# EAGLE design prominifinal-singlelayer (EAGLE 9.5.1)
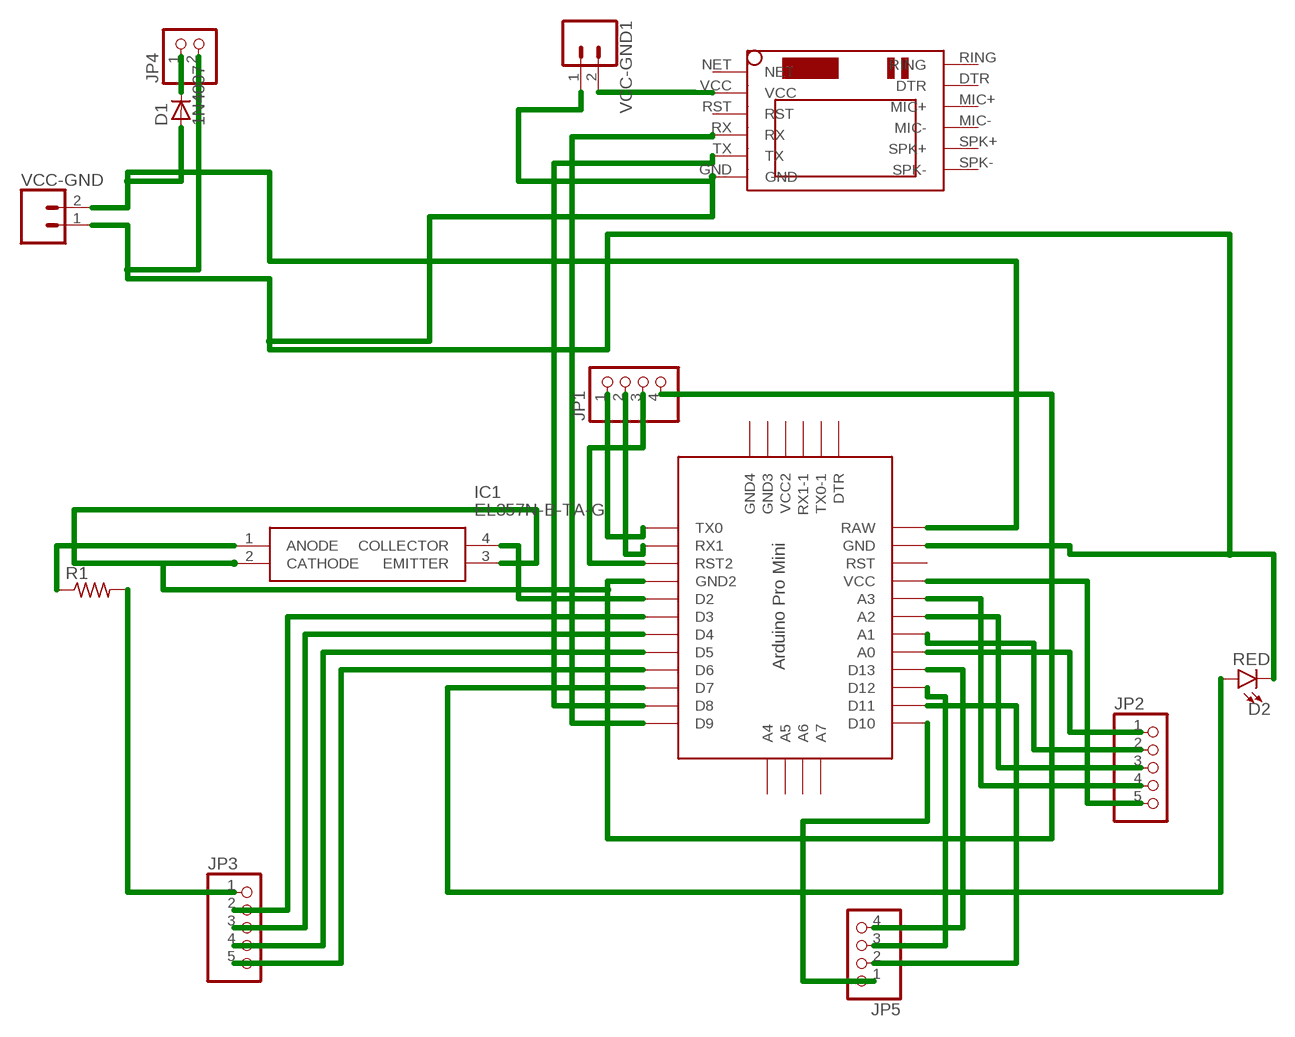
[diagram p0: schematic, sheet 1]

## Parts
D1  1N4007  [SMA]
D2  RED  LED-RED1206  [LED-1206]
IC1  EL357N-B-TA-G  [SOP254P700X200-4N]
JP1  PINHD-1X4  [1X04]
JP2  PINHD-1X5  [1X05]
JP3  PINHD-1X5  [1X05]
JP4  PINHD-1X2  [1X02]
JP5  PINHD-1X4  [1X04]
PROMINI  PRO-MINI  [PRO-MINI]
R1  R-US_R1206  [R1206]
U$1  SIM800LMODULE  [SIM800LMODULE]
VCC-GND  CONN_025MM  [SCREWTERMINAL-5MM-2]
VCC-GND1  CONN_025MM  [SCREWTERMINAL-5MM-2]

## Nets
N$1: D1.A PROMINI.RAW VCC-GND.2
N$2: JP1.1 PROMINI.TX0
N$3: IC1.2(CATHODE) IC1.3(EMITTER) JP1.4 PROMINI.GND1(GND2)
N$4: JP2.1 PROMINI.A0
N$5: IC1.4(COLLECTOR) PROMINI.D2
N$6: PROMINI.D9 U$1.RX
N$7: D2.A PROMINI.D7
N$8: JP3.1 R1.2
N$9: JP3.2 PROMINI.D3
N$10: JP3.3 PROMINI.D4
N$11: JP5.4 PROMINI.D13
N$12: JP3.5 PROMINI.D6
N$13: JP2.2 PROMINI.A1
N$14: JP1.2 PROMINI.RX1
N$15: PROMINI.D8 U$1.TX
N$16: JP2.3 PROMINI.A2
N$17: JP2.4 PROMINI.A3
N$18: JP1.3 PROMINI.RST1(RST2)
N$19: D2.C JP4.2 PROMINI.GND U$1.GND VCC-GND1.1 VCC-GND.1
N$20: U$1.VCC VCC-GND1.2
N$21: JP2.5 PROMINI.VCC
N$22: JP3.4 PROMINI.D5
N$23: JP5.3 PROMINI.D12
N$24: IC1.1(ANODE) R1.1
N$25: JP5.2 PROMINI.D11
N$26: JP5.1 PROMINI.D10
N$27: D1.K(C) JP4.1
Unconnected: PROMINI.A4 PROMINI.A5 PROMINI.A6 PROMINI.A7 PROMINI.DTR PROMINI.GND2(GND4) PROMINI.GND3 PROMINI.RST PROMINI.RX1-1 PROMINI.TX0-1 PROMINI.VCC1(VCC2) U$1.DTR U$1.MIC+ U$1.MIC- U$1.NET U$1.RING U$1.RST U$1.SPK+ U$1.SPK-

## Library data of the parts
D1 = casovac:1N4007
D2 = SparkFun-LED:LED-RED: Red SMD LED Used in manufacturing of most products at SparkFun Packages: 0603 - SMD 0603 package [Product Link] <http://docs.avagotech.com/docs/AV02-0551EN> 0603 SMART - SMD 0603 SMART package ( more efficient and expensive)[Product Link] <http://www.osram-os.com/Graphics/XPic2/00077099_0.pdf> 1206 - SMD1206 package [Product Link] <https://www.sparkfun.com/datasheets/DevTools/LilyPad/Q150OVS4.pdff> SparkFun Products: Pro Mini 328 -5V <https://www.sparkfun.com/products/821> RedBoard <https://www.sparkfun.com/products/12757> IOIO-OTG <https://www.sparkfun.com/products/13613>; PROD_ID: DIO-09912
IC1 = EL357N-B-TA-G:EL357N-B-TA-G: Optoisolator Transistor Output 3750Vrms 1 Channel 4-SOP (2.54mm) Source: Datasheet <https://datasheet.lcsc.com/szlcsc/1809192312_Everlight-Elec-EL357N-B-TA-G_C6649.pdf>; DESCRIPTION: Optoisolator Transistor Output 3750Vrms 1 Channel 4-SOP (2.54mm); HEIGHT: 2mm; MANUFACTURER_NAME: Everlight Elec; MANUFACTURER_PART_NUMBER: EL357N-B-TA-G
JP1 JP5 = pinhead:PINHD-1X4: PIN HEADER
JP2 JP3 = pinhead:PINHD-1X5: PIN HEADER
JP4 = pinhead:PINHD-1X2: PIN HEADER
PROMINI = Arduino-clone:PRO-MINI: Arduion Pro Mini Clone V1.0 www.betemcu.cu
R1 = rcl:R-US_: RESISTOR, American symbol; SPICEPREFIX: R
U$1 = SIM800LMODULE:SIM800LMODULE: SIM800L Module
VCC-GND VCC-GND1 = SparkFun-Retired:CONN_02: Multi connection point. Often used as Generic Header-pin footprint for 0.1 inch spaced/style header connections On any of the 0.1 inch spaced packages, you can populate with these: Break Away Headers - Straight <https://www.sparkfun.com/products/116> (PRT-00116) Break Away Male Headers - Right Angle <https://www.sparkfun.com/products/553> (PRT-00553) Female Headers <https://www.sparkfun.com/products/115> (PRT-00115) Break Away Headers - Machine Pin <https://www.sparkfun.com/products/117> (PRT-00117) Break Away Female Headers - Swiss Machine Pin <https://www.sparkfun.com/products/743> (PRT-00743) For SCREWTERMINALS and SPRING TERMINALS visit here: Screw Terimnals on SparkFun.com <https://www.sparkfun.com/search/results?term=Screw+Terminals> (5mm/3.5mm/2.54mm spacing) This device is also useful as a general connection point to wire up your design to another part of your project. Our various solder wires solder well into these plated through hole pads. Hook-Up Wire - Assortment (Stranded, 22 AWG) <https://www.sparkfun.com/products/11375> (PRT-11375) Hook-Up Wire - Assortment (Solid Core, 22 AWG) <https://www.sparkfun.com/products/11367> (PRT-11367) View the entire wire category on our website here <https://www.sparkfun.com/categories/141> Special notes: Molex polarized connector foot print use with: PRT-08233 with associated crimp pins and housings. 2.54_SCREWTERM for use with PRT-10571. 3.5mm Screw Terminal footprints for PRT-08084 5mm Screw Terminal footprints for use with PRT-08432; SF_SKU: PRT-08432

## Board
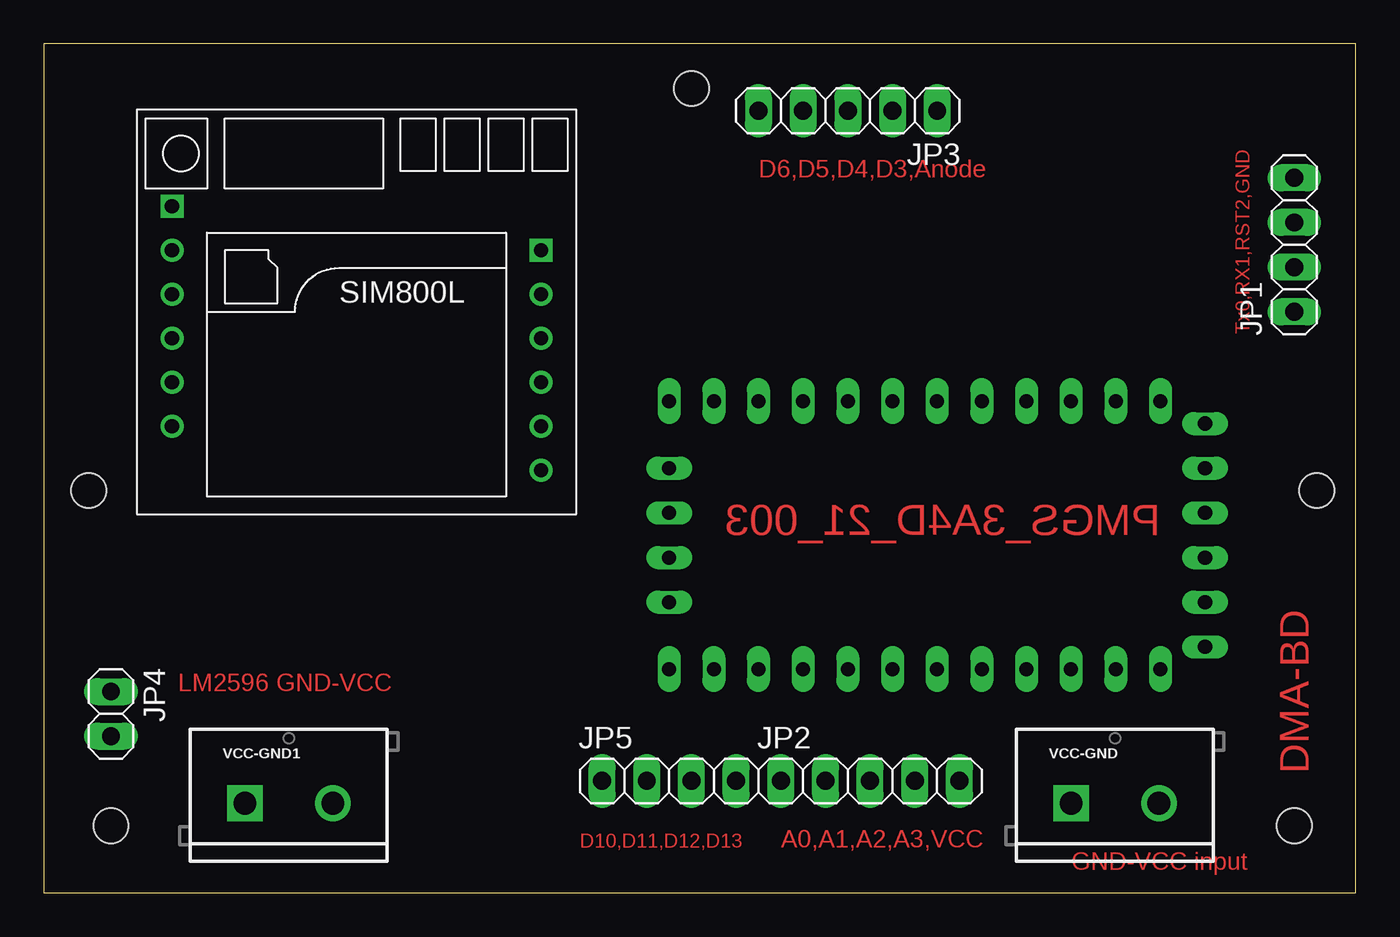
[diagram p1: board, top side]
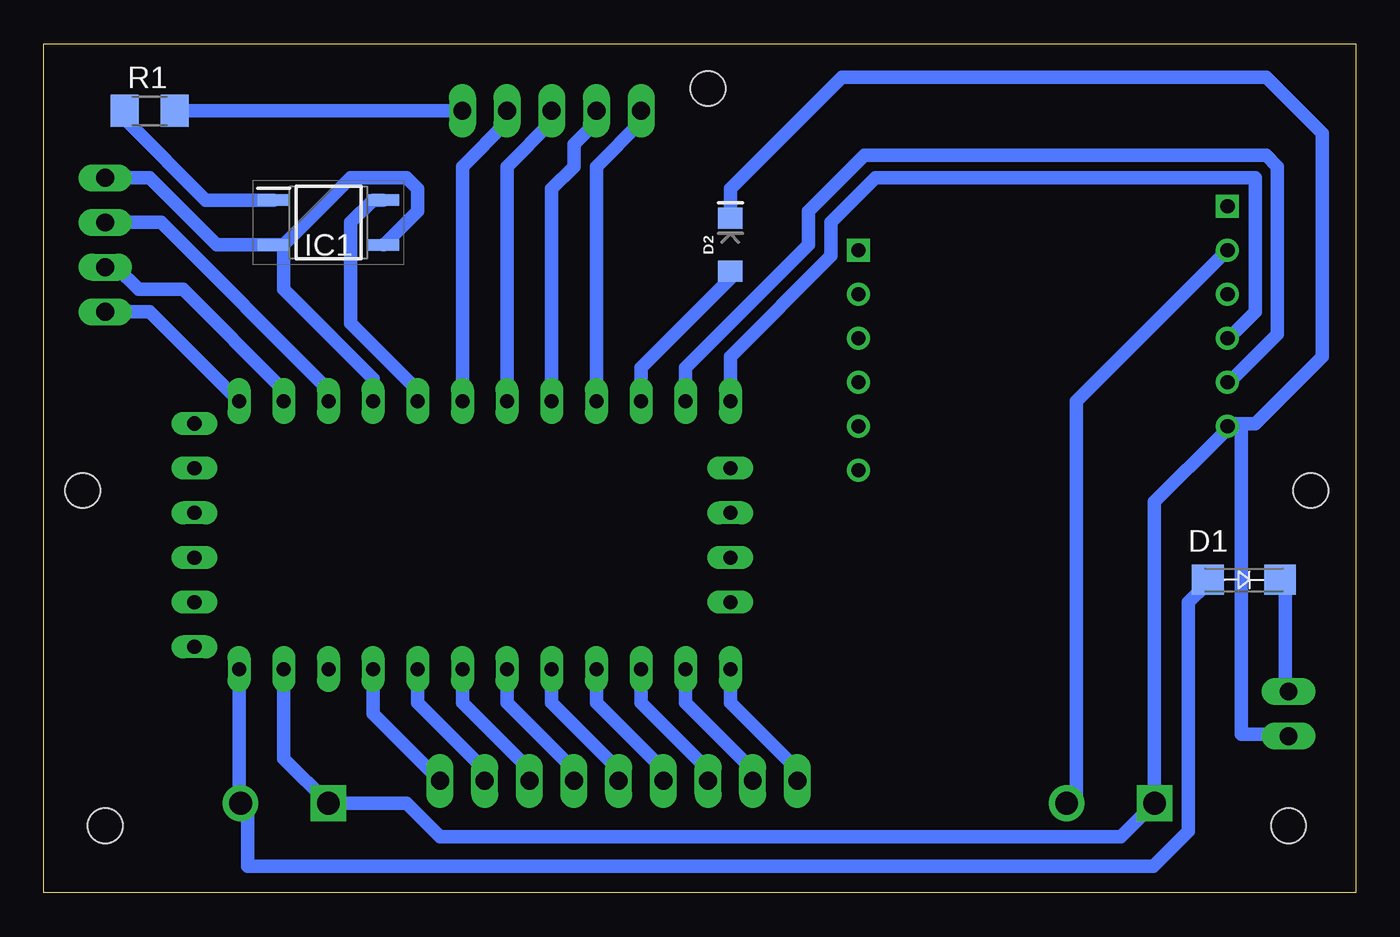
[diagram p2: board, bottom side, seen from below]

Size 74.6 x 48.25 mm. Coordinates in mm from the lower left corner, seen from the top.
Outline: 0,0 74.6,0 74.6,48.25 0,48.25 0,0
Copper layers (1*16): Top 0.035mm / dielectric 1.5mm / Bottom 0.035mm
Design rules "default *": minimum track width 30mil, minimum drill 0.35mm, track to track 20mil, track to pad 20mil, pad to pad 6mil, via to via 6mil, smd to smd 6mil, copper to edge 40mil, drill to drill 6mil, minimum pad ring 10mil, minimum via ring 8mil, stop-mask expansion 4mil, vias tented up to drill 0mil, thermal gap 10mil
Holes 2 mm at 2.54,22.86 72.39,22.86 71.12,3.81 3.81,3.81 36.83,45.72

### Footprints (pad centres in the part's own frame; a part is rotated, then mirrored left to right if it is on the bottom)
SMA = smd 1.8 x 1.7: A -2.05,0; K 2.05,0
LED-1206 = smd 1.2 x 1.4: A -1.5,0; C 1.5,0
SOP254P700X200-4N = smd 1.825 x 0.65: 1 -3.112,1.27; 2 -3.112,-1.27; 3 3.112,-1.27; 4 3.112,1.27
1X04 = drill 1.016 long: 1 -3.81,0; 2 -1.27,0; 3 1.27,0; 4 3.81,0
1X05 = drill 1.016 long: 1 -5.08,0; 2 -2.54,0; 3 0,0; 4 2.54,0; 5 5.08,0
1X02 = drill 1.016 long: 1 -1.27,0; 2 1.27,0
PRO-MINI = drill 0.8 long: A0 8.89,8.89; A1 8.89,11.43; A2 8.89,13.97; A3 8.89,16.51; A4 -2.54,-1.27; A5 0,-1.27; A6 2.54,-1.27; A7 5.08,-1.27; D2 -6.35,16.51; D3 -6.35,13.97; D4 -6.35,11.43; D5 -6.35,8.89; D6 -6.35,6.35; D7 -6.35,3.81; D8 -6.35,1.27; D9 -6.35,-1.27; D10 8.89,-1.27; D11 8.89,1.27; D12 8.89,3.81; D13 8.89,6.35; DTR 7.62,29.21; GND 8.89,24.13; GND1 -6.35,19.05; GND2 -5.08,29.21; GND3 -2.54,29.21; RAW 8.89,26.67; RST 8.89,21.59; RST1 -6.35,21.59; RX1 -6.35,24.13; RX1-1 2.54,29.21; TX0 -6.35,26.67; TX0-1 5.08,29.21; VCC 8.89,19.05; VCC1 0,29.21
R1206 = smd 1.6 x 1.803: 1 -1.422,0; 2 1.422,0
SIM800LMODULE = drill 0.8: DTR 10.5,1; GND -10.5,-6.5; MIC+ 10.5,-1.5; MIC- 10.5,-4; RST -10.5,1; RX -10.5,-1.5; SPK+ 10.5,-6.5; SPK- 10.5,-9; TX -10.5,-4; VCC -10.5,3.5 | drill 0.8 square: NET -10.5,6; RING 10.5,3.5
SCREWTERMINAL-5MM-2 = drill 1.3 pad 2.032 square: 1 0,0 | drill 1.3 pad 2.032: 2 5,0

### Placement (x,y rotation side)
D1  6.35,17.78 0 bottom
D2  35.56,36.83 90 bottom
IC1  58.42,38.1 0 bottom
JP1  71.12,36.83 90 top
JP2  46.99,6.35 0 top
JP3  45.72,44.45 180 top
JP4  3.81,10.16 270 top
JP5  35.56,6.35 0 top
PROMINI  36.83,21.59 270 top
R1  68.58,44.45 0 bottom
U$1  17.78,33.02 0 top
VCC-GND  58.42,5.08 0 top
VCC-GND1  11.43,5.08 0 top

### Tracks (layer width: path | path; a pad name or v marks a point on that pad's centre or on a via)
N$1
  Bottom 0.762: PROMINI.RAW 63.5,5.08 VCC-GND.2 63,5 63,1.5 11.5,1.5 9.5,3.5 9.5,16.5 8.5,17.5 D1.A
N$2
  Bottom 0.762: PROMINI.TX0 68.58,33.02 JP1.1
N$3
  Bottom 0.762: 60.96,36.83 57.15,40.64 53.98,40.64 53.34,40.01 53.34,38.73 55.24,36.83 IC1.3 | PROMINI.GND1 55.88,29.21 60.96,34.29 60.96,36.83 | 60.96,36.83 IC1.2 64.77,36.83 68.58,40.64 JP1.4
N$4
  Bottom 0.762: PROMINI.A0 45.72,10.79 41.91,6.99 JP2.1
N$5
  Bottom 0.762: PROMINI.D2 53.34,28.57 57.15,32.38 57.15,38.1 55.88,39.37 IC1.4
N$6
  Bottom 0.762: PROMINI.D9 35.56,30.48 29.84,36.2 29.84,38.1 27.3,40.64 5.71,40.64 5.71,33.02 6.99,31.75 U$1.RX
N$7
  Bottom 0.762: PROMINI.D7 40.64,29.84 35.56,34.92 D2.A
N$8
  Bottom 0.762: JP3.1 R1.2
N$9
  Bottom 0.762: PROMINI.D3 50.8,41.27 48.26,43.81 JP3.2
N$10
  Bottom 0.762: PROMINI.D4 48.26,41.27 45.72,43.81 JP3.3
N$11
  Bottom 0.762: PROMINI.D13 43.18,10.79 39.37,6.99 JP5.4
N$12
  Bottom 0.762: PROMINI.D6 43.18,41.27 40.64,43.81 JP3.5
N$13
  Bottom 0.762: PROMINI.A1 48.26,10.79 44.45,6.99 JP2.2
N$14
  Bottom 0.762: PROMINI.RX1 60.96,28.57 66.67,34.29 69.22,34.29 70.48,35.56 JP1.2
N$15
  Bottom 0.762: PROMINI.D8 38.1,29.84 31.11,36.83 31.11,38.73 27.94,41.91 5.08,41.91 4.45,41.27 4.45,31.75 6.99,29.21 U$1.TX
N$16
  Bottom 0.762: PROMINI.A2 50.8,10.79 46.99,6.99 JP2.3
N$17
  Bottom 0.762: PROMINI.A3 53.34,10.79 49.53,6.99 JP2.4
N$18
  Bottom 0.762: PROMINI.RST1 58.42,28.57 67.94,38.1 JP1.3
N$19
  Bottom 0.762: PROMINI.GND 60.96,7.62 VCC-GND.1 53.98,5.08 52.07,3.17 13.34,3.17 VCC-GND1.1 11.43,22.23 7.62,26.04 U$1.GND 6.99,26.67 6.5,26.67 | D2.C 35.56,40.01 29.21,46.35 5.08,46.35 1.91,43.18 1.91,30.48 5.71,26.67 6.5,26.67 | 6.5,26.67 6.5,9 4,9 JP4.2
N$20
  Bottom 0.762: U$1.VCC 7.62,36.2 15.88,27.94 15.88,5.08 VCC-GND1.2
N$21
  Bottom 0.762: PROMINI.VCC 55.88,10.16 JP2.5
N$22
  Bottom 0.762: PROMINI.D5 45.72,40.01 44.45,41.27 44.45,42.55 43.18,43.81 JP3.4
N$23
  Bottom 0.762: PROMINI.D12 40.64,10.79 36.83,6.99 JP5.3
N$24
  Bottom 0.762: IC1.1 65.41,39.37 69.85,43.81 69.85,44.45 R1.1
N$25
  Bottom 0.762: PROMINI.D11 38.1,10.79 34.29,6.99 JP5.2
N$26
  Bottom 0.762: PROMINI.D10 35.56,10.79 31.75,6.99 JP5.1
N$27
  Bottom 0.762: D1.K 4,17.5 4,11.5 JP4.1

### Text on the board
Top: D6,D5,D4,D3,Anode | Tx0,RX1,RST2,GND | PMGS_3A4D_21_003 | LM2596 GND-VCC | DMA-BD | D10,D11,D12,D13 | A0,A1,A2,A3,VCC | GND-VCC input